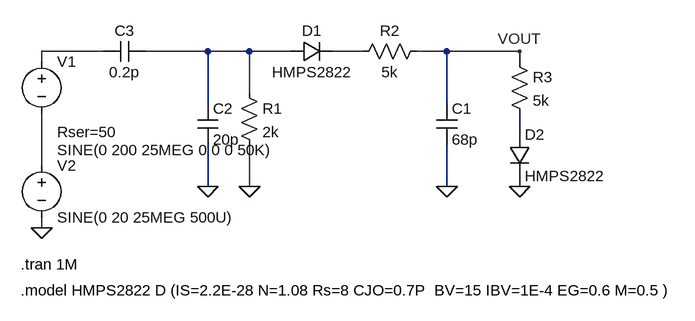
[diagram p0: schematic umd_detector_bat15099.asc]
umd_detector_bat15099.asc, the LTspice schematic file:
Version 4
SHEET 1 1368 680
WIRE -16 48 -112 48
WIRE 144 48 48 48
WIRE 208 48 144 48
WIRE 272 48 208 48
WIRE 384 48 336 48
WIRE 512 48 464 48
WIRE 624 48 512 48
WIRE -112 64 -112 48
WIRE 624 64 624 48
WIRE 208 112 208 48
WIRE 144 128 144 48
WIRE 512 128 512 48
WIRE 624 176 624 144
WIRE -112 224 -112 144
WIRE 144 256 144 192
WIRE 208 256 208 192
WIRE 512 256 512 192
WIRE 624 256 624 240
WIRE -112 320 -112 304
FLAG 208 256 0
FLAG 512 256 0
FLAG 624 256 0
FLAG -112 320 0
FLAG 624 48 VOUT
FLAG 144 256 0
SYMBOL res 192 96 R0
SYMATTR InstName R1
SYMATTR Value 2k
SYMBOL diode 272 64 R270
WINDOW 0 32 32 VTop 2
WINDOW 3 0 32 VBottom 2
SYMATTR InstName D1
SYMATTR Value HMPS2822
SYMBOL res 480 32 R90
WINDOW 0 0 56 VBottom 2
WINDOW 3 32 56 VTop 2
SYMATTR InstName R2
SYMATTR Value 5k
SYMBOL cap 496 128 R0
SYMATTR InstName C1
SYMATTR Value 68p
SYMBOL res 608 48 R0
SYMATTR InstName R3
SYMATTR Value 5k
SYMBOL diode 608 176 R0
SYMATTR InstName D2
SYMATTR Value HMPS2822
SYMBOL voltage -112 48 R0
WINDOW 3 24 152 Left 2
WINDOW 123 0 0 Left 2
WINDOW 39 24 124 Left 2
SYMATTR Value SINE(0 200 25MEG 0 0 0 50K)
SYMATTR SpiceLine Rser=50
SYMATTR InstName V1
SYMBOL cap 128 128 R0
SYMATTR InstName C2
SYMATTR Value 20p
SYMBOL cap 48 32 R90
WINDOW 0 0 32 VBottom 2
WINDOW 3 32 32 VTop 2
SYMATTR InstName C3
SYMATTR Value 0.2p
SYMBOL voltage -112 208 R0
WINDOW 123 0 0 Left 2
WINDOW 39 0 0 Left 2
SYMATTR InstName V2
SYMATTR Value SINE(0 20 25MEG 500U)
TEXT -144 416 Left 2 !.model HMPS2822 D (IS=2.2E-28 N=1.08 Rs=8 CJO=0.7P  BV=15 IBV=1E-4 EG=0.6 M=0.5 )
TEXT -144 376 Left 2 !.tran 1M

The netlist it stands for:
* umd_detector_bat15099.asc
R1 N002 0 2k
D1 N002 N003 HMPS2822
R2 VOUT N003 5k
C1 VOUT 0 68p
R3 VOUT N004 5k
D2 N004 0 HMPS2822
V1 N001 N005 SINE(0 200 25MEG 0 0 0 50K) Rser=50
C2 N002 0 20p
C3 N002 N001 0.2p
V2 N005 0 SINE(0 20 25MEG 500U)
.model D D
.lib standard.dio
.model HMPS2822 D (IS=2.2E-28 N=1.08 Rs=8 CJO=0.7P  BV=15 IBV=1E-4 EG=0.6 M=0.5 )
.tran 1M
.backanno
.end